# EAGLE design Actionneur_Gros_Robot (EAGLE 9.6.2)

## Sheet 1 of 2: SERVO DRIVER
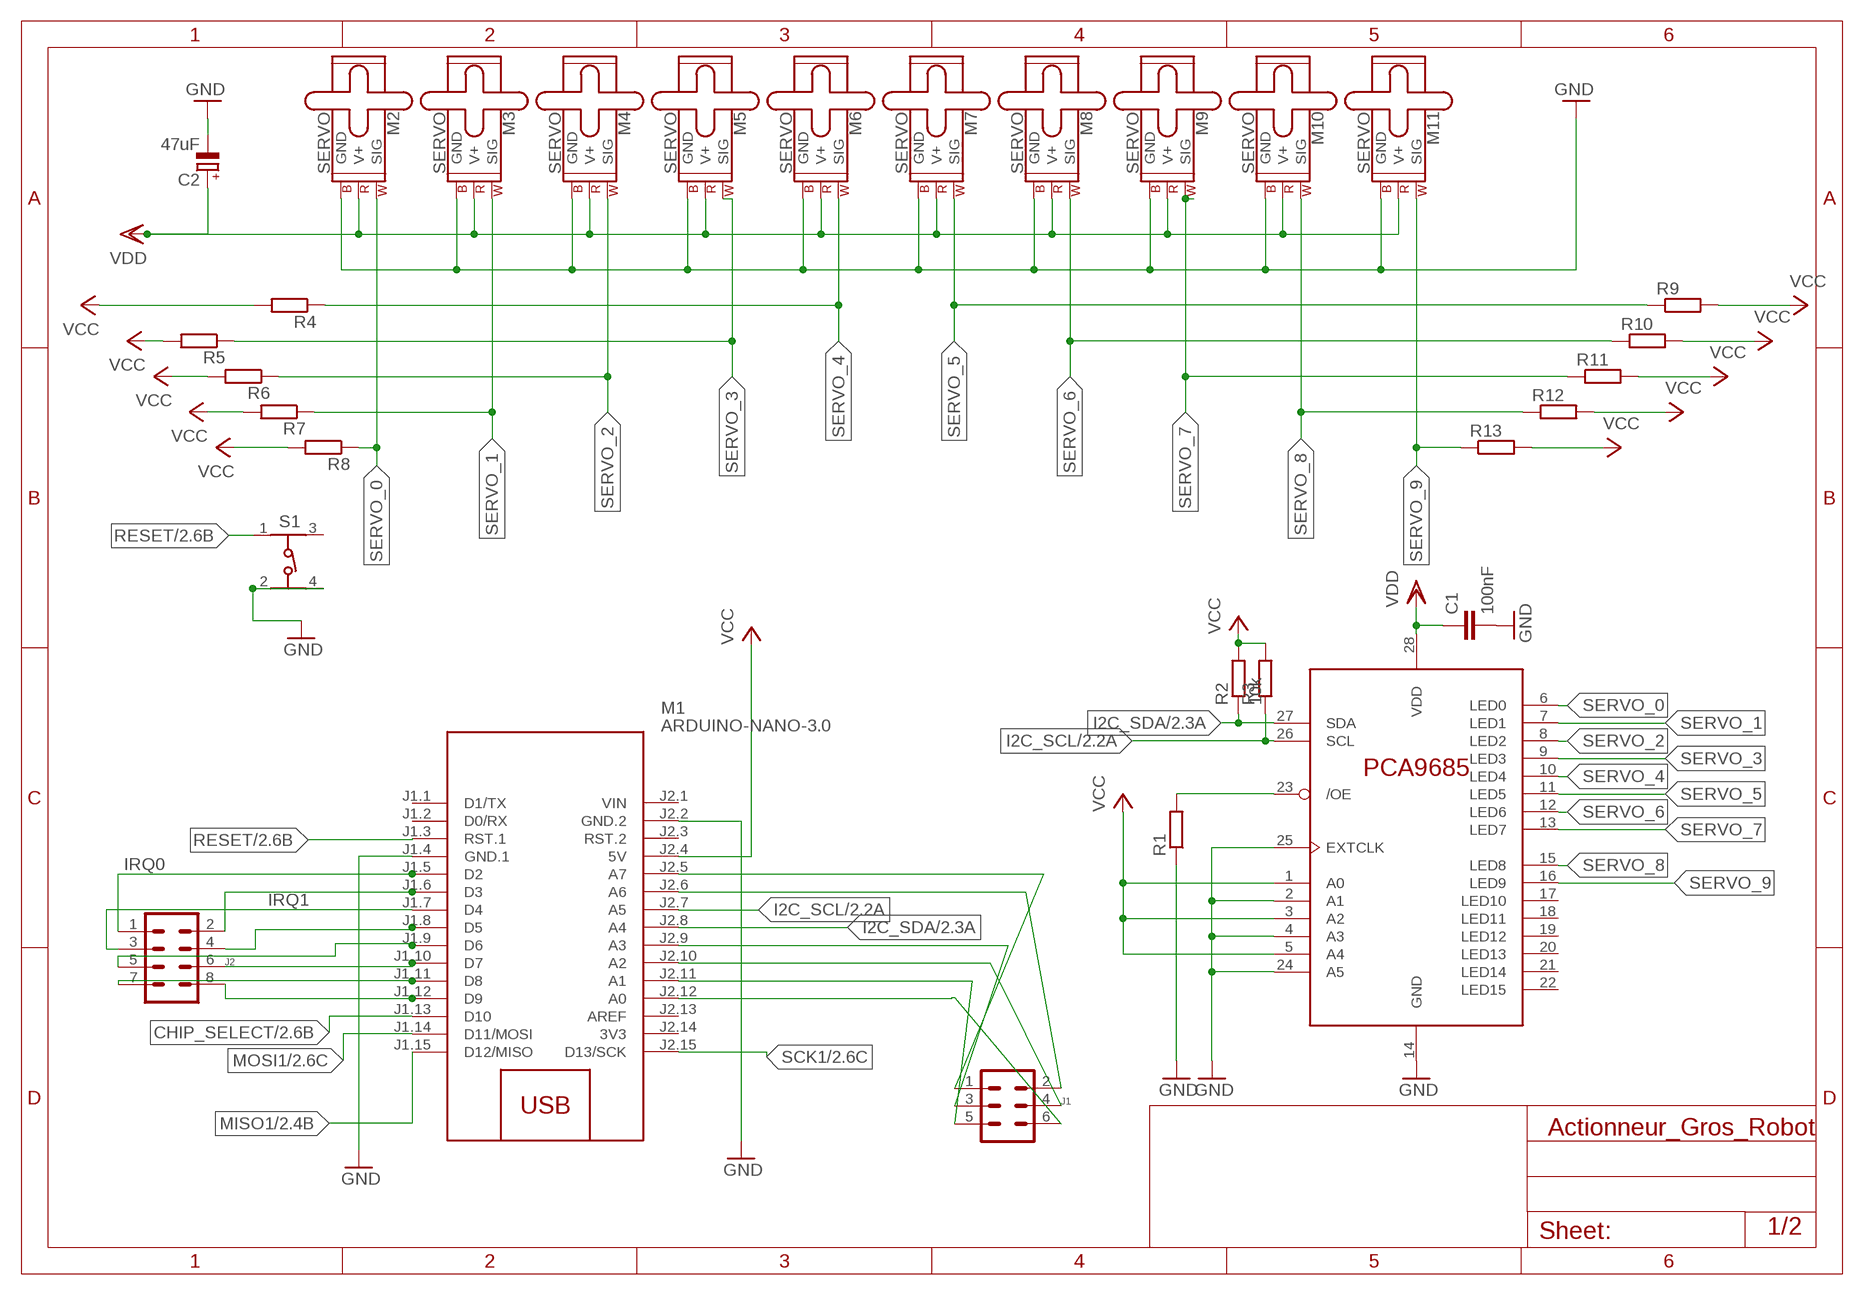
[diagram p0: schematic, sheet 1]

### Parts
C1  100nF  C-EU025-025X050  [C025-025X050]
C2  47uF  CPOL-EUE2.5-7  [E2,5-7]
J1  MA03-2  [MA03-2]
J2  MA04-2  [MA04-2]
M1  ARDUINO-NANO-3.0  [ARDUINO-NANO-3.0]
M2  SERVO  [1X03]
M3  SERVO  [1X03]
M4  SERVO  [1X03]
M5  SERVO  [1X03]
M6  SERVO  [1X03]
M7  SERVO  [1X03]
M8  SERVO  [1X03]
M9  SERVO  [1X03]
M10  SERVO  [1X03]
M11  SERVO  [1X03]
R1  R-EU_0204/7  [0204/7]
R2  10k  R-EU_0204/7  [0204/7]
R3  R-EU_0204/7  [0204/7]
R4  R-EU_0204/7  [0204/7]
R5  R-EU_0204/7  [0204/7]
R6  R-EU_0204/7  [0204/7]
R7  R-EU_0204/7  [0204/7]
R8  R-EU_0204/7  [0204/7]
R9  R-EU_0204/7  [0204/7]
R10  R-EU_0204/7  [0204/7]
R11  R-EU_0204/7  [0204/7]
R12  R-EU_0204/7  [0204/7]
R13  R-EU_0204/7  [0204/7]
S1  430182043816  [430182043816]
U$1  PCA9685PW  [TSSOP28]

### Nets
CHIP_SELECT: M1.J1.13(D10) ; also sheet 2
GND: C1.2 C2.- M1.J1.4(GND.1) M1.J2.2(GND.2) M2.3(GND) M3.3(GND) M4.3(GND) M5.3(GND) M6.3(GND) M7.3(GND) M8.3(GND) M9.3(GND) M10.3(GND) M11.3(GND) R1.1 S1.2 S1.4 U$1.2(A1) U$1.4(A3) U$1.14(GND) U$1.24(A5) U$1.25(EXTCLK) ; also sheet 2
I2C_SCL: M1.J2.7(A5) R3.1 U$1.26(SCL) ; also sheet 2
I2C_SDA: M1.J2.8(A4) R2.1 U$1.27(SDA) ; also sheet 2
IRQ0: J2.1 M1.J1.5(D2)
IRQ1: J2.2 M1.J1.6(D3)
MISO1: M1.J1.15(D12/MISO) ; also sheet 2
MOSI1: M1.J1.14(D11/MOSI) ; also sheet 2
N$1: R1.2 U$1.23(/OE)
N$2: J1.6 M1.J2.12(A0)
N$3: J1.5 M1.J2.11(A1)
N$4: J1.3 M1.J2.9(A3)
N$5: J1.4 M1.J2.10(A2)
N$6: J1.2 M1.J2.6(A6)
N$7: J1.1 M1.J2.5(A7)
N$8: J2.8 M1.J1.12(D9)
N$9: J2.7 M1.J1.11(D8)
N$10: J2.6 M1.J1.10(D7)
N$11: J2.5 M1.J1.9(D6)
N$12: J2.4 M1.J1.8(D5)
N$13: J2.3 M1.J1.7(D4)
RESET: M1.J1.3(RST.1) S1.1 ; also sheet 2
SCK1: M1.J2.15(D13/SCK) ; also sheet 2
SERVO_0: M2.1(SIG) R8.1 U$1.6(LED0)
SERVO_1: M3.1(SIG) R7.1 U$1.7(LED1)
SERVO_2: M4.1(SIG) R6.1 U$1.8(LED2)
SERVO_3: M5.1(SIG) R5.1 U$1.9(LED3)
SERVO_4: M6.1(SIG) R4.1 U$1.10(LED4)
SERVO_5: M7.1(SIG) R9.1 U$1.11(LED5)
SERVO_6: M8.1(SIG) R10.1 U$1.12(LED6)
SERVO_7: M9.1(SIG) R11.1 U$1.13(LED7)
SERVO_8: M10.1(SIG) R12.1 U$1.15(LED8)
SERVO_9: M11.1(SIG) R13.1 U$1.16(LED9)
VCC: C1.1 M1.J2.4(5V) R2.2 R3.2 R4.2 R5.2 R6.2 R7.2 R8.2 R9.2 R10.2 R11.2 R12.2 R13.2 U$1.1(A0) U$1.3(A2) U$1.5(A4) U$1.28(VDD) ; supply symbol labelled VDD ; also sheet 2
VDD: C2.+ M2.2(V+) M3.2(V+) M4.2(V+) M5.2(V+) M6.2(V+) M7.2(V+) M8.2(V+) M9.2(V+) M10.2(V+) M11.2(V+) ; also sheet 2
Unconnected: M1.J1.1(D1/TX) M1.J1.2(D0/RX) M1.J2.3(RST.2) M1.J2.13(AREF) S1.3 U$1.17(LED10) U$1.18(LED11) U$1.19(LED12) U$1.20(LED13) U$1.21(LED14) U$1.22(LED15)

## Sheet 2 of 2: CAN AND STEPPER MOTORS
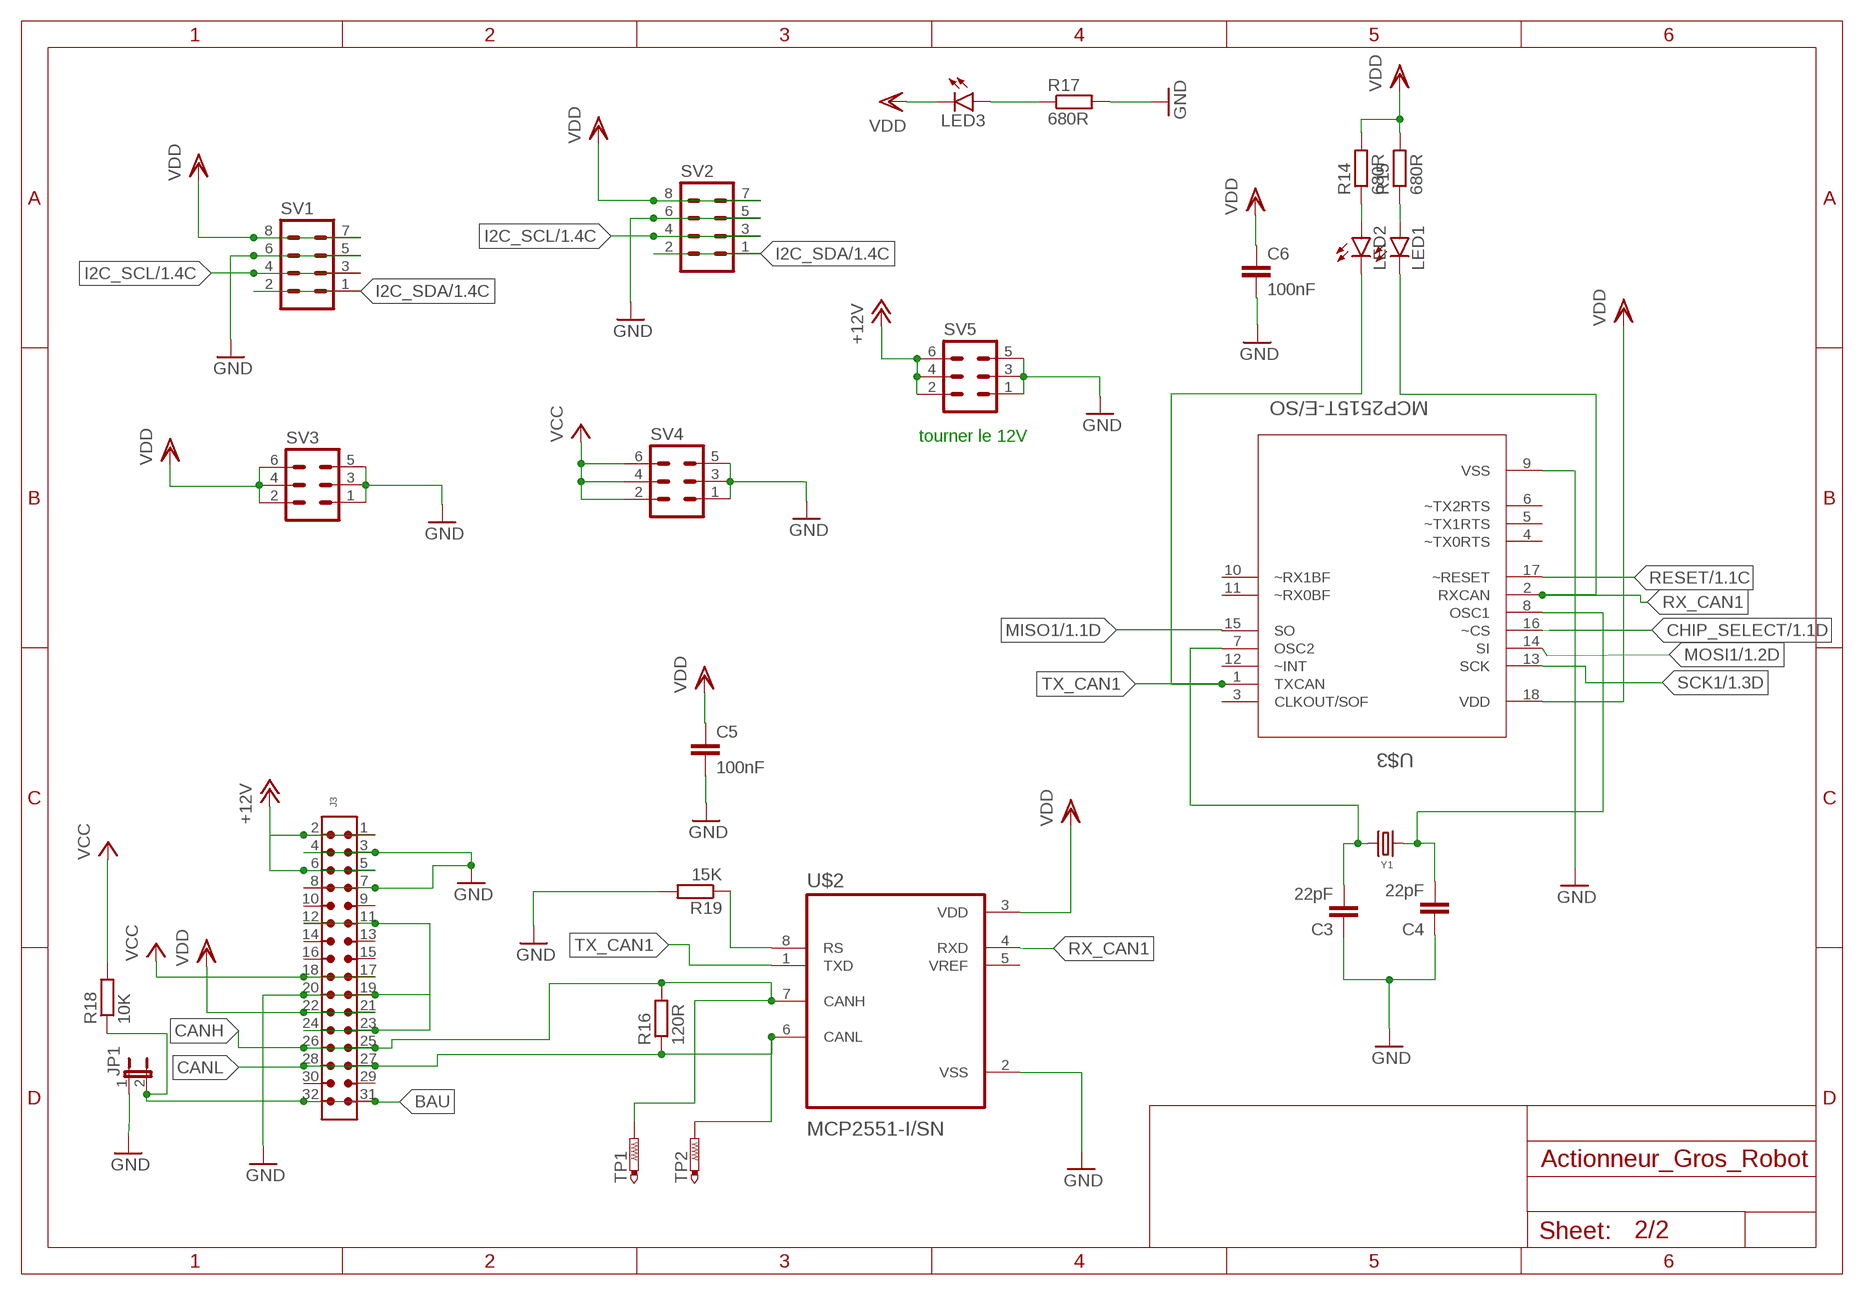
[diagram p1: schematic, sheet 2]

### Parts
C3  22pF  C-EU025-025X050  [C025-025X050]
C4  22pF  C-EU025-025X050  [C025-025X050]
C5  100nF  C-EU025-025X050  [C025-025X050]
C6  100nF  C-EU025-025X050  [C025-025X050]
J3  6130XX21021_61303221021  [61303221021]
JP1  JP1E  [JP1]
LED1  LED3MM  [LED3MM]
LED2  LED3MM  [LED3MM]
LED3  LED3MM  [LED3MM]
R14  680R  R-EU_0207/10  [0207/10]
R15  680R  R-EU_0207/10  [0207/10]
R16  120R  R-EU_0207/7  [0207/7]
R17  680R  R-EU_0207/7  [0207/7]
R18  10K  R-EU_0207/7  [0207/7]
R19  15K  R-EU_0207/7  [0207/7]
SV1  MA04-2  [MA04-2]
SV2  MA04-2  [MA04-2]
SV3  MA03-2  [MA03-2]
SV4  MA03-2  [MA03-2]
SV5  MA03-2  [MA03-2]
TP1  PTR1PAD1-17  [P1-17]
TP2  PTR1PAD1-17  [P1-17]
U$2  MCP2551-I/SN  [SOIC127P599X175-8N]
U$3  MCP2515T-E/SO  [SOIC127P1030X265-18N]
Y1  16MHz  CRYTALHC49UP  [HC49UP]

### Nets
+12V: J3.1 J3.2 SV5.2 SV5.4 SV5.6
BAU: J3.31 J3.32 JP1.2 R18.1
CANH: J3.25 J3.26 R16.2 TP1.TP U$2.7(CANH)
CANL: J3.27 J3.28 R16.1 TP2.TP U$2.6(CANL)
CHIP_SELECT: U$3.16(~CS) ; also sheet 1
GND: C3.1 C4.1 C5.2 C6.2 J3.3 J3.4 J3.7 J3.8 J3.11 J3.12 J3.19 J3.20 J3.23 J3.24 JP1.1 R17.2 R19.2 SV1.5 SV1.6 SV2.5 SV2.6 SV3.1 SV3.3 SV3.5 SV4.1 SV4.3 SV4.5 SV5.1 SV5.3 SV5.5 U$2.2(VSS) U$3.9(VSS) ; also sheet 1
I2C_SCL: SV1.3 SV1.4 SV2.3 SV2.4 ; also sheet 1
I2C_SDA: SV1.1 SV1.2 SV2.1 SV2.2 ; also sheet 1
MISO1: U$3.15(SO) ; also sheet 1
MOSI1: U$3.14(SI) ; also sheet 1
N$14: J3.5 J3.6
N$15: R19.1 U$2.8(RS)
N$16: LED1.A R15.1
N$17: LED2.A R14.1
N$20: LED3.A R17.1
N$21: C4.2 U$3.8(OSC1) Y1.1
N$24: C3.2 U$3.7(OSC2) Y1.2
RESET: U$3.17(~RESET) ; also sheet 1
RX_CAN1: LED1.K(C) U$2.4(RXD) U$3.2(RXCAN)
SCK1: U$3.13(SCK) ; also sheet 1
TX_CAN1: LED2.K(C) U$2.1(TXD) U$3.1(TXCAN)
VCC: J3.17 J3.18 R18.2 SV4.2 SV4.4 SV4.6 ; also sheet 1
VDD: C5.1 C6.1 J3.21 J3.22 LED3.K(C) R14.2 R15.2 SV1.7 SV1.8 SV2.7 SV2.8 SV3.2 SV3.4 SV3.6 U$2.3(VDD) U$3.18(VDD) ; also sheet 1
Unconnected: J3.9 J3.10 J3.13 J3.14 J3.15 J3.16 J3.29 J3.30 U$2.5(VREF) U$3.3(CLKOUT/SOF) U$3.4(~TX0RTS) U$3.5(~TX1RTS) U$3.6(~TX2RTS) U$3.10(~RX1BF) U$3.11(~RX0BF) U$3.12(~INT)

### Notes on the sheet
- tourner le 12V

## Power pins joined to a net without a drawn wire
3V3: M1.J2.14(3V3)
VIN: M1.J2.1(VIN)

## Library data of the parts
C1 C3-C6 = rcl:C-EU: CAPACITOR, European symbol; SPICEPREFIX: C
C2 = rcl:CPOL-EU: POLARIZED CAPACITOR, European symbol; SPICEPREFIX: C
J1 SV3-SV5 = con-lstb:MA03-2: PIN HEADER; OC_FARNELL: unknown; OC_NEWARK: unknown
J2 SV1 SV2 = con-lstb:MA04-2: PIN HEADER; OC_FARNELL: unknown; OC_NEWARK: unknown
J3 = Wurth_Connectors_WR-PHD:6130XX21021_61303221021: WR-PHD 2.54 mm THT Angled Dual Pin Header ARTICLE PROPERTIES: Pins:4;​ 6;​ 8;​ 10;​ 12;​ 14;​ 16;​ 18;​ 20;​ 22;​ 24;​ 26;​ 32;​ 34;​ 36;​ 40;​ 64;​ 72 KIND PROPERTIES: Pitch：2.54 mm Quality Class:3 as per CECC 75 301-802 Rows：Dual Gender：Pin Header Type：Angled;​ Board Stacker MATERIAL PROPERTIES: Insulator Material :PA6T Insulator Flammability Rating:UL94 V-0 Contact Material:Copper Alloy Contact Plating:Gold Contact Type:Stamped GENERAL INFORMATION Operating Temperature:-40 up to +105 °C Compliance:RoHS ELECTRICAL PROPERTIES: Rated Current:3 A IR 1:3 A Withstanding Voltage:500 V (AC) Contact Resistance:20 mΩ RISO:1000 MΩ CERTIFICATION UL Approval:E323964 PACKAGING PROPERTIES Packaging:Bag <https://katalog.we-online.com/media/images/v2/o33214v209%20Family_wr-phd_6130XX21021.jpg> Details see: https://katalog.we-online.com/en/em/PHD_2_54_THT_ANGLED_DUAL_PIN_HEADER_6130XX21021 Updated by Yingchun,Shan 2019-10-16 2019 (C) Würth Elektronik; DATASHEET-URL: https://katalog.we-online.com/em/datasheet/61303221021.pdf; GENDER: Pin Header; IR: 3A; MATES: WR-PHD 2.54mm Angled DualSocket Header/Dual Socket Header/Dual Socket Header Bottom Entry/Dual Socket Header Bottom Entry Large/SMT Dual Socket Header/SMT Dual Socket Header Bottom Entry; PACKAGING: Bag; PART-NUMBER: 61303221021; PINS: 32; ROWS: Dual; TYPE: Angled
JP1 = jumper:JP1E: JUMPER
LED1-LED3 = led:LED: LED OSRAM: - CHIPLED LG R971, LG N971, LY N971, LG Q971, LY Q971, LO R971, LY R971 LH N974, LH R974 LS Q976, LO Q976, LY Q976 LO Q996 - Hyper CHIPLED LW Q18S LB Q993, LB Q99A, LB R99A - SideLED LS A670, LO A670, LY A670, LG A670, LP A670 LB A673, LV A673, LT A673, LW A673 LH A674 LY A675 LS A676, LA A676, LO A676, LY A676, LW A676 LS A679, LY A679, LG A679 - Hyper Micro SIDELED® LS Y876, LA Y876, LO Y876, LY Y876 LT Y87S - SmartLED LW L88C, LW L88S LB L89C, LB L89S, LG L890 LS L89K, LO L89K, LY L89K LS L896, LA L896, LO L896, LY L896 - TOPLED LS T670, LO T670, LY T670, LG T670, LP T670 LSG T670, LSP T670, LSY T670, LOP T670, LYG T670 LG T671, LOG T671, LSG T671 LB T673, LV T673, LT T673, LW T673 LH T674 LS T676, LA T676, LO T676, LY T676, LB T676, LH T676, LSB T676, LW T676 LB T67C, LV T67C, LT T67C, LS T67K, LO T67K, LY T67K, LW E67C LS E67B, LA E67B, LO E67B, LY E67B, LB E67C, LV E67C, LT E67C LW T67C LS T679, LY T679, LG T679 LS T770, LO T770, LY T770, LG T770, LP T770 LB T773, LV T773, LT T773, LW T773 LH T774 LS E675, LA E675, LY E675, LS T675 LS T776, LA T776, LO T776, LY T776, LB T776 LHGB T686 LT T68C, LB T68C - Hyper Mini TOPLED® LB M676 - Mini TOPLED Santana® LG M470 LS M47K, LO M47K, LY M47K Source: http://www.osram.convergy.de LUXEON: - LUMILED® LXK2-PW12-R00, LXK2-PW12-S00, LXK2-PW14-U00, LXK2-PW14-V00 LXK2-PM12-R00, LXK2-PM12-S00, LXK2-PM14-U00 LXK2-PE12-Q00, LXK2-PE12-R00, LXK2-PE12-S00, LXK2-PE14-T00, LXK2-PE14-U00 LXK2-PB12-K00, LXK2-PB12-L00, LXK2-PB12-M00, LXK2-PB14-N00, LXK2-PB14-P00, LXK2-PB14-Q00 LXK2-PR12-L00, LXK2-PR12-M00, LXK2-PR14-Q00, LXK2-PR14-R00 LXK2-PD12-Q00, LXK2-PD12-R00, LXK2-PD12-S00 LXK2-PH12-R00, LXK2-PH12-S00 LXK2-PL12-P00, LXK2-PL12-Q00, LXK2-PL12-R00 Source: www.luxeon.com KINGBRIGHT: KA-3528ASYC Source: www.kingbright.com
M1 = diy-modules2:ARDUINO-NANO-3.0: Arduino Nano 3.0 and compatible devices More details available here: https://www.arduino.cc/en/Main/ArduinoBoardNano Click here to find device on ebay.com <http://www.ebay.com/sch/arduino+nano>
M2-M11 = SparkFun-Electromechanical:SERVO: Servo Motor 3-pin connector for a standard servo motor (voltage supply, ground, and control signal.) SparkFun Products Servo - Generic (Sub-Micro Size) <https://www.sparkfun.com/products/9065> (ROB-09065) Servo - Generic High Torque Continuous Rotation (Standard Size) <https://www.sparkfun.com/products/9347> (ROB-09347) Servo - Generic High Torque (Standard Size) <https://www.sparkfun.com/products/11965> (ROB-11965)
R1-R19 = rcl:R-EU_: RESISTOR, European symbol; SPICEPREFIX: R
S1 = Wurth_Switch_WS-TASV:430182043816: WS-TASV SMT Tact Switch 6x6 mm Material Properties Cover Material : Stainless Steel Properties Actuator Material:LCP Actuator Flammability :UL94 V-0 Rating Actuator Color:Black; Salmon; White Frame Material:LCP Flammability Rating:UL94 V-0 Frame Color:Black Contact Material:Stainless Steel Contact Plating:Silver Terminal Material:Copper Alloy Terminal Plating:Silver VR:12 V (DC) Contact Resistance Initial:100 mΩ Contact Resistance After Life Test:2Ω RISO:100 MΩ Withstanding Voltage:250 V (AC) Washable:No Qty.:4000;5000 Mechanical Properties Electrical Life:400; 550; 1000 Stroke :0.25 mm General Information Operating Temperature:-40 up to +85 °C Washable:No Packaging Properties Packaging:Tape and Reel <https://www.we-online.com/catalog/media/o37470v209%20Family_WS-TASV_6x6mm_SMD_Tact_Switch_4301820xx8xx.jpg> Details see: https://www.we-online.com/catalog/en/TASV_6X6_SMD/ Updated by yingchun,Shan;2020-02-18 2020(C) Würth Elektronik; DATASHEET-URL: https://www.we-online.com/catalog/datasheet/430182043816.pdf; H: 4.3mm; OPERATION-FORCE: 160g; PART-NUMBER: 430182043816; QTY: 1000
TP1 TP2 = testpad:PTR1: TEST PIN
U$1 = i2c-led-controller:PCA9685
U$2 = MCP2551-I_SN:MCP2551-I/SN: Check prices <https://pricing.snapeda.com/parts/MCP2551-I/SN/Microchip/view-part?ref=eda>; AVAILABILITY: Good; DESCRIPTION: 1/1 Transceiver Half CANbus 8-SOIC; MF: Microchip; MP: MCP2551-I/SN; PACKAGE: SOIC-8 Microchip; PRICE: None; PURCHASE-URL: https://pricing.snapeda.com/search/part/MCP2551-I/SN/?ref=eda
U$3 = MCP2515-I_P:MCP2515T-E/SO: Stand-Alone CAN Controller Check prices <https://pricing.snapeda.com/parts/MCP2515T-E/SO/Microchip/view-part?ref=eda>; AVAILABILITY: No availability data; DESCRIPTION: CANbus Controller CAN 2.0 SPI Interface 18-SOIC; MF: Microchip; MP: MCP2515T-E/SO; PACKAGE: SOIC-18 Microchip; PRICE: None
Y1 = crystal:CRYTAL: CRYSTAL

## Board
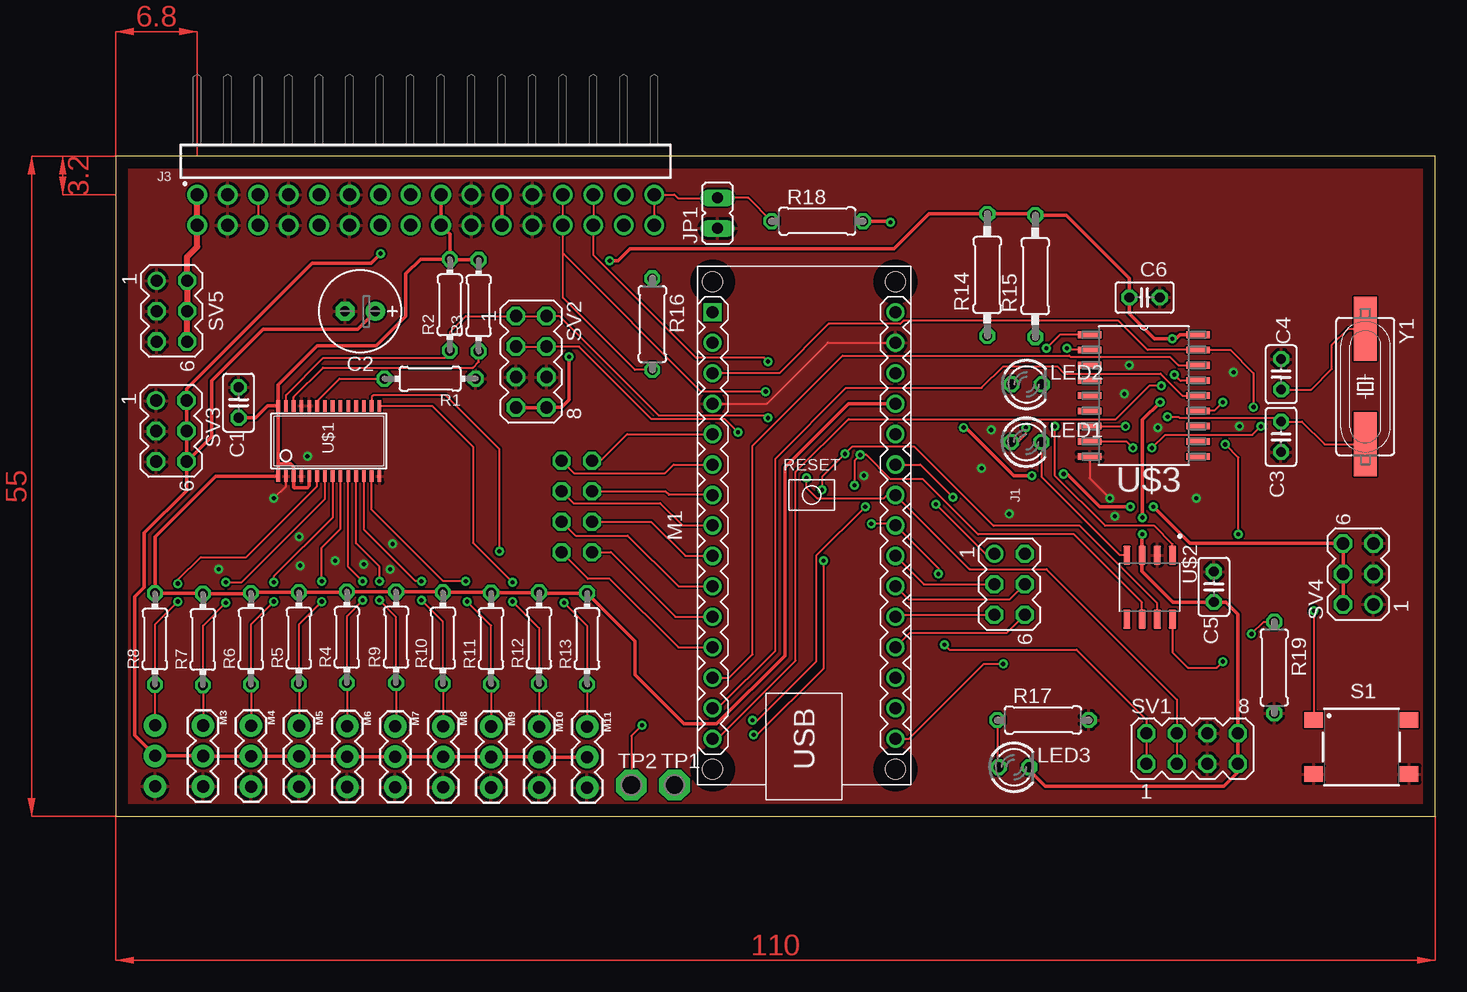
[diagram p2: board, top side]
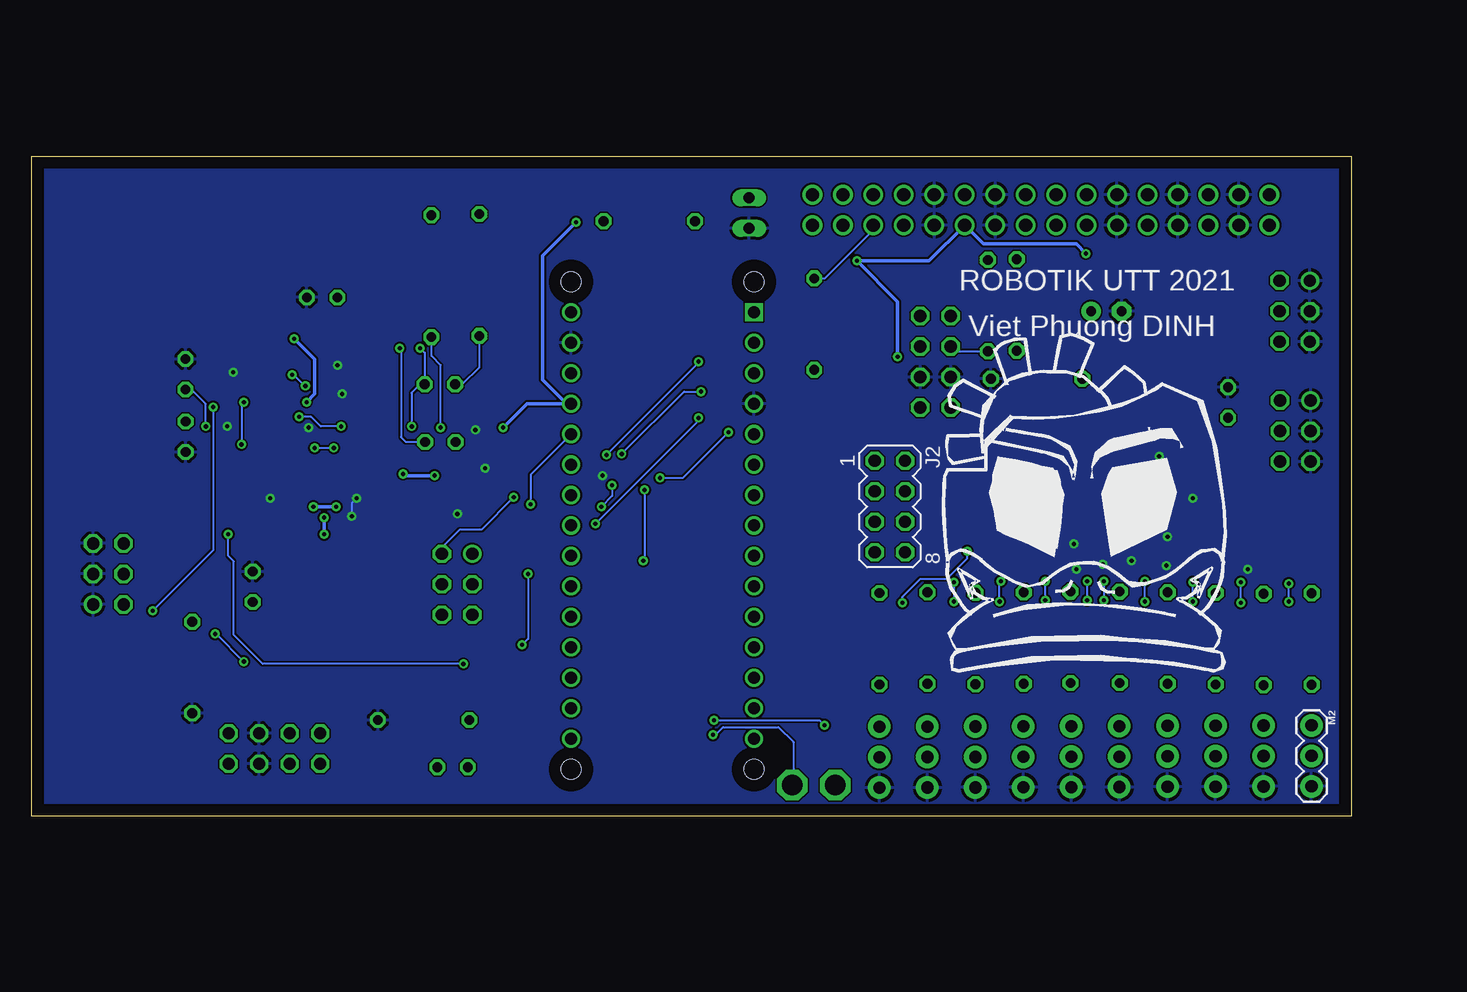
[diagram p3: board, bottom side, seen from below]

Size 110 x 55 mm. Coordinates in mm from the lower left corner, seen from the top.
Outline: 0,0 110,0 110,55 0,55 0,0
Copper layers (1*16): Top 0.035mm / dielectric 1.5mm / Bottom 0.035mm
Design rules "default": minimum track width 6mil, minimum drill 0.35mm, track to track 6mil, track to pad 6mil, pad to pad 6mil, via to via 6mil, smd to smd 6mil, copper to edge 40mil, drill to drill 6mil, minimum pad ring 10mil, minimum via ring 8mil, stop-mask expansion 4mil, vias tented up to drill 0mil, thermal gap 10mil

### Footprints (pad centres in the part's own frame; a part is rotated, then mirrored left to right if it is on the bottom)
C025-025X050 = drill 0.813 octagon: 1 -1.27,0; 2 1.27,0
E2,5-7 = drill 0.813 pad 1.6: + -1.27,0 | drill 0.813 pad 1.6 octagon: - 1.27,0
MA03-2 = drill 1.016: 1 -2.54,-1.27 | drill 1.016 octagon: 2 -2.54,1.27; 3 0,-1.27; 4 0,1.27; 5 2.54,-1.27; 6 2.54,1.27
MA04-2 = drill 1.016 octagon: 1 -3.81,-1.27; 2 -3.81,1.27; 3 -1.27,-1.27; 4 -1.27,1.27; 5 1.27,-1.27; 6 1.27,1.27; 7 3.81,-1.27; 8 3.81,1.27
61303221021 = drill 1.1: 1 19.05,2.77; 2 19.05,5.31; 3 16.51,2.77; 4 16.51,5.31; 5 13.97,2.77; 6 13.97,5.31; 7 11.43,2.77; 8 11.43,5.31; 9 8.89,2.77; 10 8.89,5.31; 11 6.35,2.77; 12 6.35,5.31; 13 3.81,2.77; 14 3.81,5.31; 15 1.27,2.77; 16 1.27,5.31; 17 -1.27,2.77; 18 -1.27,5.31; 19 -3.81,2.77; 20 -3.81,5.31; 21 -6.35,2.77; 22 -6.35,5.31; 23 -8.89,2.77; 24 -8.89,5.31; 25 -11.43,2.77; 26 -11.43,5.31; 27 -13.97,2.77; 28 -13.97,5.31; 29 -16.51,2.77; 30 -16.51,5.31; 31 -19.05,2.77; 32 -19.05,5.31
JP1 = drill 0.914 long: 1 0,-1.27; 2 0,1.27
LED3MM = drill 0.813 octagon: A -1.27,0; K 1.27,0
ARDUINO-NANO-3.0 = drill 1 square: J1.1 17.78,7.62 | drill 1: J1.2 15.24,7.62; J1.3 12.7,7.62; J1.4 10.16,7.62; J1.5 7.62,7.62; J1.6 5.08,7.62; J1.7 2.54,7.62; J1.8 0,7.62; J1.9 -2.54,7.62; J1.10 -5.08,7.62; J1.11 -7.62,7.62; J1.12 -10.16,7.62; J1.13 -12.7,7.62; J1.14 -15.24,7.62; J1.15 -17.78,7.62; J2.1 17.78,-7.62; J2.2 15.24,-7.62; J2.3 12.7,-7.62; J2.4 10.16,-7.62; J2.5 7.62,-7.62; J2.6 5.08,-7.62; J2.7 2.54,-7.62; J2.8 0,-7.62; J2.9 -2.54,-7.62; J2.10 -5.08,-7.62; J2.11 -7.62,-7.62; J2.12 -10.16,-7.62; J2.13 -12.7,-7.62; J2.14 -15.24,-7.62; J2.15 -17.78,-7.62 | hole 1.651: -20.32,7.62; -20.32,-7.62; 20.32,-7.62; 20.32,7.62
1X03 = drill 1.016 pad 1.88: 1 0,0; 2 2.54,0; 3 5.08,0
0204/7 = drill 0.813 octagon: 1 -3.81,0; 2 3.81,0
0207/10 = drill 0.813 octagon: 1 -5.08,0; 2 5.08,0
0207/7 = drill 0.813 octagon: 1 -3.81,0; 2 3.81,0
430182043816 = smd 1.55 x 1.3: 1 -3.975,2.25; 2 -3.975,-2.25; 3 3.975,2.25; 4 3.975,-2.25
P1-17 = drill 1.702 pad 2.54 octagon: TP 0,0
TSSOP28 = smd 0.305 x 0.991: 1 -4.225,-2.918; 2 -3.575,-2.918; 3 -2.925,-2.918; 4 -2.275,-2.918; 5 -1.625,-2.918; 6 -0.975,-2.918; 7 -0.325,-2.918; 8 0.325,-2.918; 9 0.975,-2.918; 10 1.625,-2.918; 11 2.275,-2.918; 12 2.925,-2.918; 13 3.575,-2.918; 14 4.225,-2.918; 15 4.225,2.918; 16 3.575,2.918; 17 2.925,2.918; 18 2.275,2.918; 19 1.625,2.918; 20 0.975,2.918; 21 0.325,2.918; 22 -0.325,2.918; 23 -0.975,2.918; 24 -1.625,2.918; 25 -2.275,2.918; 26 -2.925,2.918; 27 -3.575,2.918; 28 -4.225,2.918
SOIC127P599X175-8N = smd 1.58 x 0.6: 1 -2.67,1.905; 2 -2.67,0.635; 3 -2.67,-0.635; 4 -2.67,-1.905; 5 2.67,-1.905; 6 2.67,-0.635; 7 2.67,0.635; 8 2.67,1.905
SOIC127P1030X265-18N = smd 1.981 x 0.559: 1 -4.521,5.08; 2 -4.521,3.81; 3 -4.521,2.54; 4 -4.521,1.27; 5 -4.521,0; 6 -4.521,-1.27; 7 -4.521,-2.54; 8 -4.521,-3.81; 9 -4.521,-5.08; 10 4.521,-5.08; 11 4.521,-3.81; 12 4.521,-2.54; 13 4.521,-1.27; 14 4.521,0; 15 4.521,1.27; 16 4.521,2.54; 17 4.521,3.81; 18 4.521,5.08
HC49UP = smd 5.334 x 1.93: 1 -4.826,0; 2 4.826,0

### Placement (x,y rotation side)
C1  10.26,34.48 90 top
C2  20.4,42.09 180 top
C3  97.16,31.63 90 top
C4  97.17,36.84 270 top
C5  91.56,19.13 90 top
C6  85.78,43.24 0 top
J1  74.53,19.34 270 top
J2  38.45,25.82 270 bottom
J3  25.86,54.58 180 top
JP1  50.18,50.27 0 top
LED1  75.92,31.2 0 top
LED2  75.96,36 0 top
LED3  74.9,4.1 0 top
M1  57.4,24.24 90 top
M2  3.3,7.58 270 bottom
M3  7.3,7.57 270 top
M4  11.3,7.56 270 top
M5  15.3,7.55 270 top
M6  19.32,7.52 270 top
M7  23.32,7.51 270 top
M8  27.32,7.5 270 top
M9  31.32,7.49 270 top
M10  35.32,7.48 270 top
M11  39.32,7.47 270 top
R1  26.22,36.47 180 top
R2  27.87,42.62 90 top
R3  30.27,42.56 90 top
R4  19.29,14.92 90 top
R5  15.29,14.86 90 top
R6  11.29,14.8 90 top
R7  7.29,14.74 90 top
R8  3.29,14.78 90 top
R9  23.39,14.92 90 top
R10  27.29,14.86 90 top
R11  31.31,14.82 90 top
R12  35.31,14.86 90 top
R13  39.31,14.8 90 top
R14  72.67,45.12 90 top
R15  76.67,45.02 90 top
R16  44.75,41.02 270 top
R17  77.32,8.03 0 top
R18  58.5,49.6 0 top
R19  96.6,12.4 270 top
S1  103.86,5.78 0 top
SV1  89.75,5.65 0 top
SV2  34.65,37.88 270 top
SV3  4.65,32.11 270 top
SV4  103.6,20.2 90 top
SV5  4.7,42.1 270 top
TP1  46.6,2.6 0 top
TP2  43,2.6 0 top
U$1  17.78,31.28 0 top
U$2  86.21,19.1 270 top
U$3  85.73,35.06 0 top
Y1  104.18,35.82 270 top

### Tracks (layer width: path | path; a pad name or v marks a point on that pad's centre or on a via)
+12V
  Top 0.508: J3.1 J3.2 6.81,47.47 5.97,46.63 SV5.2 SV5.4 SV5.6
BAU
  Top 0.152: J3.32 J3.31 46.59,51.81 46.9,51.5 50.14,51.5 JP1.2 52.75,51.54 R18.1
CANH  (via drill 0.35)
  Top 0.152: J3.25 J3.26 37.29,46.91 | U$2.7 86.84,17.75 80.4,24.2 73.2,24.2 66.6,30.8 61.4,30.8 v60.8,30.2 58.9,28.3 v58.9,27.2 | v54.2,35.4 48.8,35.4 37.29,46.91 | R16.2 43.29,37.21 37.29,43.21 37.29,46.91 | v59.01,21.3 59.01,12.31 53.49,6.79 v53.2,6.79
  Bottom 0.152: v60.8,30.2 55.6,35.4 v54.2,35.4 | v58.9,27.2 58.9,21.41 v59.01,21.3 | v53.2,6.79 53,6.79 52.35,7.44 47.74,7.44 46.5,6.2 46.5,2.7 TP1.TP
CANL  (via drill 0.35)
  Top 0.152: J3.27 J3.28 39.83,46.77 48.4,38.2 54.1,38.2 v54.4,37.9 | U$2.6 85.58,17.82 79.9,23.5 71.9,23.5 67.3,28.1 64.6,28.1 62.58,30.12 v62.08,30.12 61.6,29.64 v61.6,27.6 | v62.5,25.8 58.4,21.7 58.4,12.9 53.5,8 v53.1,8 | v43.9,7.6 43,6.7 TP2.TP
  Bottom 0.152: v62.08,30.12 54.4,37.8 v54.4,37.9 | J3.28 39.83,48.87 43.87,44.83 R16.1 | v61.6,27.6 61.6,26.7 v62.5,25.8 | v53.1,8 44.3,8 v43.9,7.6
CHIP_SELECT
  Top 0.152: M1.J1.13 51.14,11.54 53.1,13.5 53.1,30.9 60.6,38.4 79.5,38.4 79.6,38.3 87.9,38.3 88.6,37.6 U$3.16
GND  (via drill 0.35)
  Top 0.152: M1.J1.4 54.3,34.4 59.38,39.48 M1.J2.2 | U$3.9 81.21,28.19 v82.9,26.5 | v13.2,26.5 14.21,27.5 U$1.2
  Bottom 0.152: v82.9,26.5 83.3,26.1 v83.3,25
  other vias: 72.2,29 84.1,35.2 90.1,26.5 62.4,28.4 84.5,37.6 93.2,37 74.5,25.2 73,32.2 93.7,32.5 86.9,32.4 16,30 15.3,23.3 15.4,20.9 20.7,21 8.6,20.6 23.1,22.7 22.9,20.6 18.3,21.3
  pour Top: -14.6,65.5 113.1,65.5 113.1,-14 112.9,-14.2 -11.6,-14.2 -12.1,-13.7 -14.6,-11.2
  pour Bottom: -13.8,66.3 113.1,66.3 113.1,-14 112.9,-14.2 -12.7,-14.2 -13.8,-13.1
I2C_SCL  (via drill 0.35)
  Top 0.152: SV1.3 SV1.4 88.48,9.72 77.6,20.6 71.2,20.6 M1.J2.7 64.32,26.78 64.02,26.48 58.52,26.48 57.6,27.4 v57.6,28.2 | v51.9,32 50.8,33.1 44.7,33.1 38.65,39.15 SV2.4 SV2.3 | U$1.26 14.86,34.95 17.3,37.4 29.8,37.4 30.27,37.87 R3.1
  Bottom 0.152: v57.6,28.2 55.7,28.2 v51.9,32 | SV2.3 32.98,38.75 R3.1
I2C_SDA  (via drill 0.35)
  Top 0.152: M1.J2.8 65.5,24.24 | v69.1,14.3 69.5,13.9 80.1,13.9 85.94,8.06 SV1.2 SV1.1 | M1.J2.8 64.89,24.37 v63,24.37 | v54.4,33.2 54.2,33.41 45.3,33.41 37.02,41.69 SV2.2 SV2.1 29.19,41.69 27.87,40.37 R2.1 27.87,38.57 27.5,38.2 17.3,38.2 14.21,35.1 U$1.27 | M1.J2.8 68.6,20.66 v68.6,20.2
  Bottom 0.152: v63,24.37 54.4,32.97 v54.4,33.2 | v69.1,14.3 68.6,14.8 v68.6,20.2
IRQ0
  Top 0.152: J2.1 40.43,29.63 42.66,31.86 M1.J1.5
IRQ1
  Top 0.152: J2.2 38.21,28.6 45.8,28.6 46.52,29.32 M1.J1.6
MISO1  (via drill 0.35)
  Top 0.152: M1.J1.15 50.18,6.46 56.7,12.98 56.7,28.7 61.1,33.1 83.4,33.1 86.17,35.87 v87.17,35.87 | U$3.15 90.21,36.29 88.77,36.29 v88.27,36.79
  Bottom 0.152: v87.17,35.87 87.25,35.87 88.17,36.79 v88.27,36.79
MOSI1
  Top 0.152: M1.J1.14 50.2,9 55,13.8 55,29.8 60.9,35.7 72.2,35.7 74,37.5 78.5,37.5 79.1,36.9 87.1,36.9 88.94,35.06 U$3.14
N$1
  Top 0.152: U$1.23 16.8,34.6 18.67,36.47 R1.2
N$2
  Top 0.152: M1.J2.12 66.24,15.3 74.3,15.3 J1.6
N$3
  Top 0.152: M1.J2.11 65.2,16.8 J1.5
N$4
  Top 0.152: M1.J2.9 67.38,19.34 J1.3
N$5
  Top 0.152: M1.J2.10 66.08,18.1 74.56,18.1 J1.4
N$6  (via drill 0.35)
  Top 0.152: M1.J2.6 67.08,29.32 v69.8,26.6
  Bottom 0.152: v69.8,26.6 72.5,23.9 74.3,23.9 75.8,22.4 J1.2
N$7  (via drill 0.35)
  Top 0.152: v68.4,26 72.52,21.88 J1.1
  Bottom 0.152: M1.J2.5 68.4,28.48 v68.4,26
N$8
  Top 0.152: J2.8 39.39,19.8 41.2,19.8 46.92,14.08 M1.J1.12
N$9
  Top 0.152: J2.7 41.29,22.01 46.68,16.62 M1.J1.11
N$10
  Top 0.152: J2.6 38.33,23.4 42.7,23.4 46.94,19.16 M1.J1.10
N$11
  Top 0.152: J2.5 44.65,24.55 47.5,21.7 M1.J1.9
N$12
  Top 0.152: J2.4 38.17,26.1 45.4,26.1 47.26,24.24 M1.J1.8
N$13
  Top 0.152: J2.3 45.82,27.09 46.12,26.79 M1.J1.7
N$14
  Top 0.152: J3.5 J3.6
N$15  (via drill 0.35)
  Top 0.152: U$2.8 88.11,13.69 89.4,12.4 91.8,12.4 v92.3,12.9 | v94.7,15.2 95.71,16.21 R19.1
  Bottom 0.152: v92.3,12.9 94.6,15.2 v94.7,15.2
N$16  (via drill 0.35)
  Top 0.152: LED1.A 75.25,31.2 75.9,31.85 v75.9,32.4
  Bottom 0.152: v75.9,32.4 75.9,37.6 76.67,38.37 R15.1
N$17
  Bottom 0.152: LED2.A 74.09,36 72.67,37.42 R14.1
N$20
  Top 0.152: R17.1 73.51,4.22 LED3.A
N$21  (via drill 0.35)
  Top 0.152: C4.2 99.67,35.57 101.4,37.3 101.4,39.3 102.75,40.65 Y1.1 | U$3.8 84.25,31.25 v84.8,30.7 | v86.4,30.7 87.5,31.8 94.78,31.8 v95.47,32.49
  Bottom 0.152: v86.4,30.7 v84.8,30.7 | v95.47,32.49 95.47,34.37 96.67,35.57 C4.2
N$24  (via drill 0.35)
  Top 0.152: Y1.2 100.81,30.99 98.9,32.9 C3.2 96.86,33.2 88.7,33.2 88.6,33.3 v87.7,33.3 | U$3.7 84.17,32.52 v84.2,32.49
  Bottom 0.152: v84.2,32.49 85.89,32.49 86.7,33.3 v87.7,33.3
RESET  (via drill 0.35)
  Top 0.152: M1.J1.3 55.34,36.94 59.44,41.04 65.43,41.04 65.69,41.3 83.6,41.3 86.03,38.87 U$3.17 92.93,38.87 94.86,36.94 v94.86,34.11 | v99.9,17.13 99.89,17.12 S1.1
  Bottom 0.152: v94.86,34.11 94.86,22.17 v99.9,17.13
RX_CAN1  (via drill 0.35)
  Top 0.152: LED1.K 77.19,28.31 83.73,21.77 U$2.4 | U$3.2 79.44,38.87 v79.3,39.01
  Bottom 0.152: v79.3,39.01 79.2,38.91 79.2,31.6 78.8,31.2 LED1.K
SCK1  (via drill 0.35)
  Top 0.152: M1.J2.15 66.16,6.46 72.4,12.7 v74,12.7 | v93.6,23.5 93.6,29.89 v92.5,30.99 | v92.3,34.51 91.6,33.81 90.27,33.81 U$3.13
  Bottom 0.152: v93.6,23.5 93.6,21.7 93.15,21.25 93.15,15.13 90.72,12.7 v74,12.7 | v92.3,34.51 92.5,34.31 v92.5,30.99
SERVO_0  (via drill 0.35)
  Top 0.152: M2.1 R8.1 3.29,15.99 v5.2,17.9 | v5.2,19.4 5.2,19.7 7.1,21.6 10.9,21.6 16.8,27.5 U$1.6
  Bottom 0.152: v5.2,17.9 v5.2,19.4
SERVO_1  (via drill 0.35)
  Top 0.152: M3.1 R7.1 7.29,15.89 v9.2,17.8 | U$1.7 17.45,26.45 10.5,19.5 v9.2,19.5
  Bottom 0.152: v9.2,17.8 v9.2,19.5
SERVO_2  (via drill 0.35)
  Top 0.152: M4.1 R6.1 11.29,15.99 v13.2,17.9 | U$1.8 18.11,24.91 13.2,20 v13.2,19.5
  Bottom 0.152: v13.2,17.9 v13.2,19.5
SERVO_3  (via drill 0.35)
  Top 0.152: M5.1 R5.1 15.29,15.99 v17.2,17.9 | v17.2,19.6 17.2,22.4 18.75,23.95 U$1.9
  Bottom 0.152: v17.2,17.9 v17.2,19.6
SERVO_4  (via drill 0.35)
  Top 0.152: M6.1 19.29,7.55 R4.1 19.29,16.69 v20.6,18 | v20.6,19.6 19.41,20.8 U$1.10
  Bottom 0.152: v20.6,19.6 v20.6,18
SERVO_5  (via drill 0.35)
  Top 0.152: M7.1 23.39,7.58 R9.1 23.39,16.61 v22,18 | v22,19.6 22,20.8 20.05,22.75 U$1.11
  Bottom 0.152: v22,18 v22,19.6
SERVO_6  (via drill 0.35)
  Top 0.152: M8.1 27.29,7.53 R10.1 27.29,16.21 v25.5,18 | v25.5,19.6 25,19.6 20.7,23.89 U$1.12
  Bottom 0.152: v25.5,18 v25.5,19.6
SERVO_7  (via drill 0.35)
  Top 0.152: M9.1 R11.1 31.31,15.89 v29.3,17.9 | v29.2,19.6 27.3,19.6 21.36,25.55 U$1.13
  Bottom 0.152: v29.3,17.9 29.3,19.5 v29.2,19.6
SERVO_8  (via drill 0.35)
  Top 0.152: M10.1 R12.1 35.31,15.69 v33.1,17.9 | U$1.15 26.4,34.2 29.8,30.8 29.8,22.8 v33.1,19.5
  Bottom 0.152: v33.1,19.5 v33.1,17.9
SERVO_9  (via drill 0.35)
  Top 0.152: M11.1 R13.1 39.3,15.9 v37.4,17.8 | v32,22.1 32,30.6 27.5,35.1 21.5,35.1 21.36,34.95 U$1.16
  Bottom 0.152: v37.4,17.8 37.4,18.3 35.9,19.8 33.7,19.8 32,21.5 v32,22.1
TX_CAN1  (via drill 0.35)
  Top 0.152: U$2.1 88.11,22.68 86.6,24.2 82.5,24.2 78.3,28.4 v78.3,32.49 | U$3.1 78.73,40.14 v77.6,39.01
  Bottom 0.152: v78.3,32.49 78.33,32.52 78.33,35.3 77.63,36 LED2.K 77.23,38.64 v77.6,39.01
VCC  (via drill 0.35)
  Top 0.305: SV4.2 SV4.4 SV4.6 89.57,22.74 v86.51,25.8 | M1.J2.4 61.1,34.4 55.8,29.1 55.8,13.4 50.1,7.7 47.4,7.7 43.31,11.79 43.31,14.61 R13.2 35.37,18.61 35.35,18.63 | v84.6,25.8 82.06,25.8 79.33,28.53 v79.03,28.53 | v76.4,28.4 74.9,28.4 70.9,32.4 v70.7,32.4 | 35.35,18.63 R12.2 | 35.35,18.63 R11.2 31.27,18.67 27.4,18.67 | R10.2 27.4,18.67 | 27.4,18.67 27.34,18.73 R9.2 R4.2 19.23,18.67 R5.2 11.35,18.67 R6.2 11.23,18.55 R7.2 7.25,18.59 R8.2 3.29,23.29 8.36,28.36 U$1.1 13.55,29.25 | 13.55,29.25 13.7,29.4 14.6,29.4 14.86,29.14 U$1.3 14.86,27.45 14.9,27.4 16,27.4 16.16,27.55 U$1.5 | U$1.28 13.55,29.25 | C1.1 11.7,33.2 12.7,34.2 U$1.28 | R3.2 27.93,46.37 R2.2 | R2.2 25.43,46.43 24.2,45.2 24.2,41.69 21.71,39.2 16.8,39.2 13.55,35.95 U$1.28 | R18.2 64.5,49.6 v64.6,49.5 | J3.17 J3.18 27.87,48.53 R2.2
  Bottom 0.305: v86.51,25.8 v84.6,25.8 | v79.03,28.53 78.9,28.4 v76.4,28.4 | v70.7,32.4 68.7,34.4 65.4,34.4 | 65.4,34.4 M1.J2.4 | v64.6,49.5 67.4,46.7 67.4,36.4 65.4,34.4
VDD  (via drill 0.35)
  Top 0.305: LED3.K 76.17,3.83 77.5,2.5 92.4,2.5 93.56,3.66 SV1.7 SV1.8 93.56,16.84 92.54,17.86 C5.1 88.14,17.86 85.58,20.43 U$2.3 85.58,23.48 v85.6,23.5 | v85.6,24.9 85.6,33.04 v87.08,34.52 | U$3.18 88.73,40.14 88.4,39.81 v88.1,39.81 86.59,39.81 84.51,41.89 C6.1 84.51,44.84 79.25,50.1 R15.2 76.57,50.2 R14.2 67.8,50.2 64.9,47.3 42.9,47.3 41.9,46.3 v41.2,46.3 | SV2.7 SV2.8 35.95,34.1 37.2,34.1 37.8,34.7 v37.8,38.3 | SV3.6 SV3.4 SV3.2 5.92,35.65 16.37,46.1 21.3,46.1 v22.1,46.9 | SV3.6 8,31.65 8,36.3 12.3,40.6 20.18,40.6 C2.+ | SV3.6 5.92,27.15 2.38,23.62 2.38,19.09 1.6,18.3 1.6,6.74 M2.2 M3.2 M4.2 M5.2 19.29,5.01 M6.2 M7.2 M8.2 M9.2 M10.2 M11.2 | J3.22 J3.21
  Bottom 0.305: v85.6,23.5 v85.6,24.9 | v87.08,34.52 86.4,35.2 86.4,38.11 v88.1,39.81 | v22.1,46.9 22.9,47.7 30.64,47.7 J3.22 35.18,46.3 v41.2,46.3 37.8,42.9 v37.8,38.3
(copper drawn outside any net)
  shapes: Top area x4

### Text on the board
bNames: ROBOTIK UTT 2021 | Viet Phuong DINH